# Altium schematic sheet ZHSD-DDR3L.SchDoc
size A3; DocumentNumber: 7; SheetNumber: 6; SheetTotal: 16; Size: A3
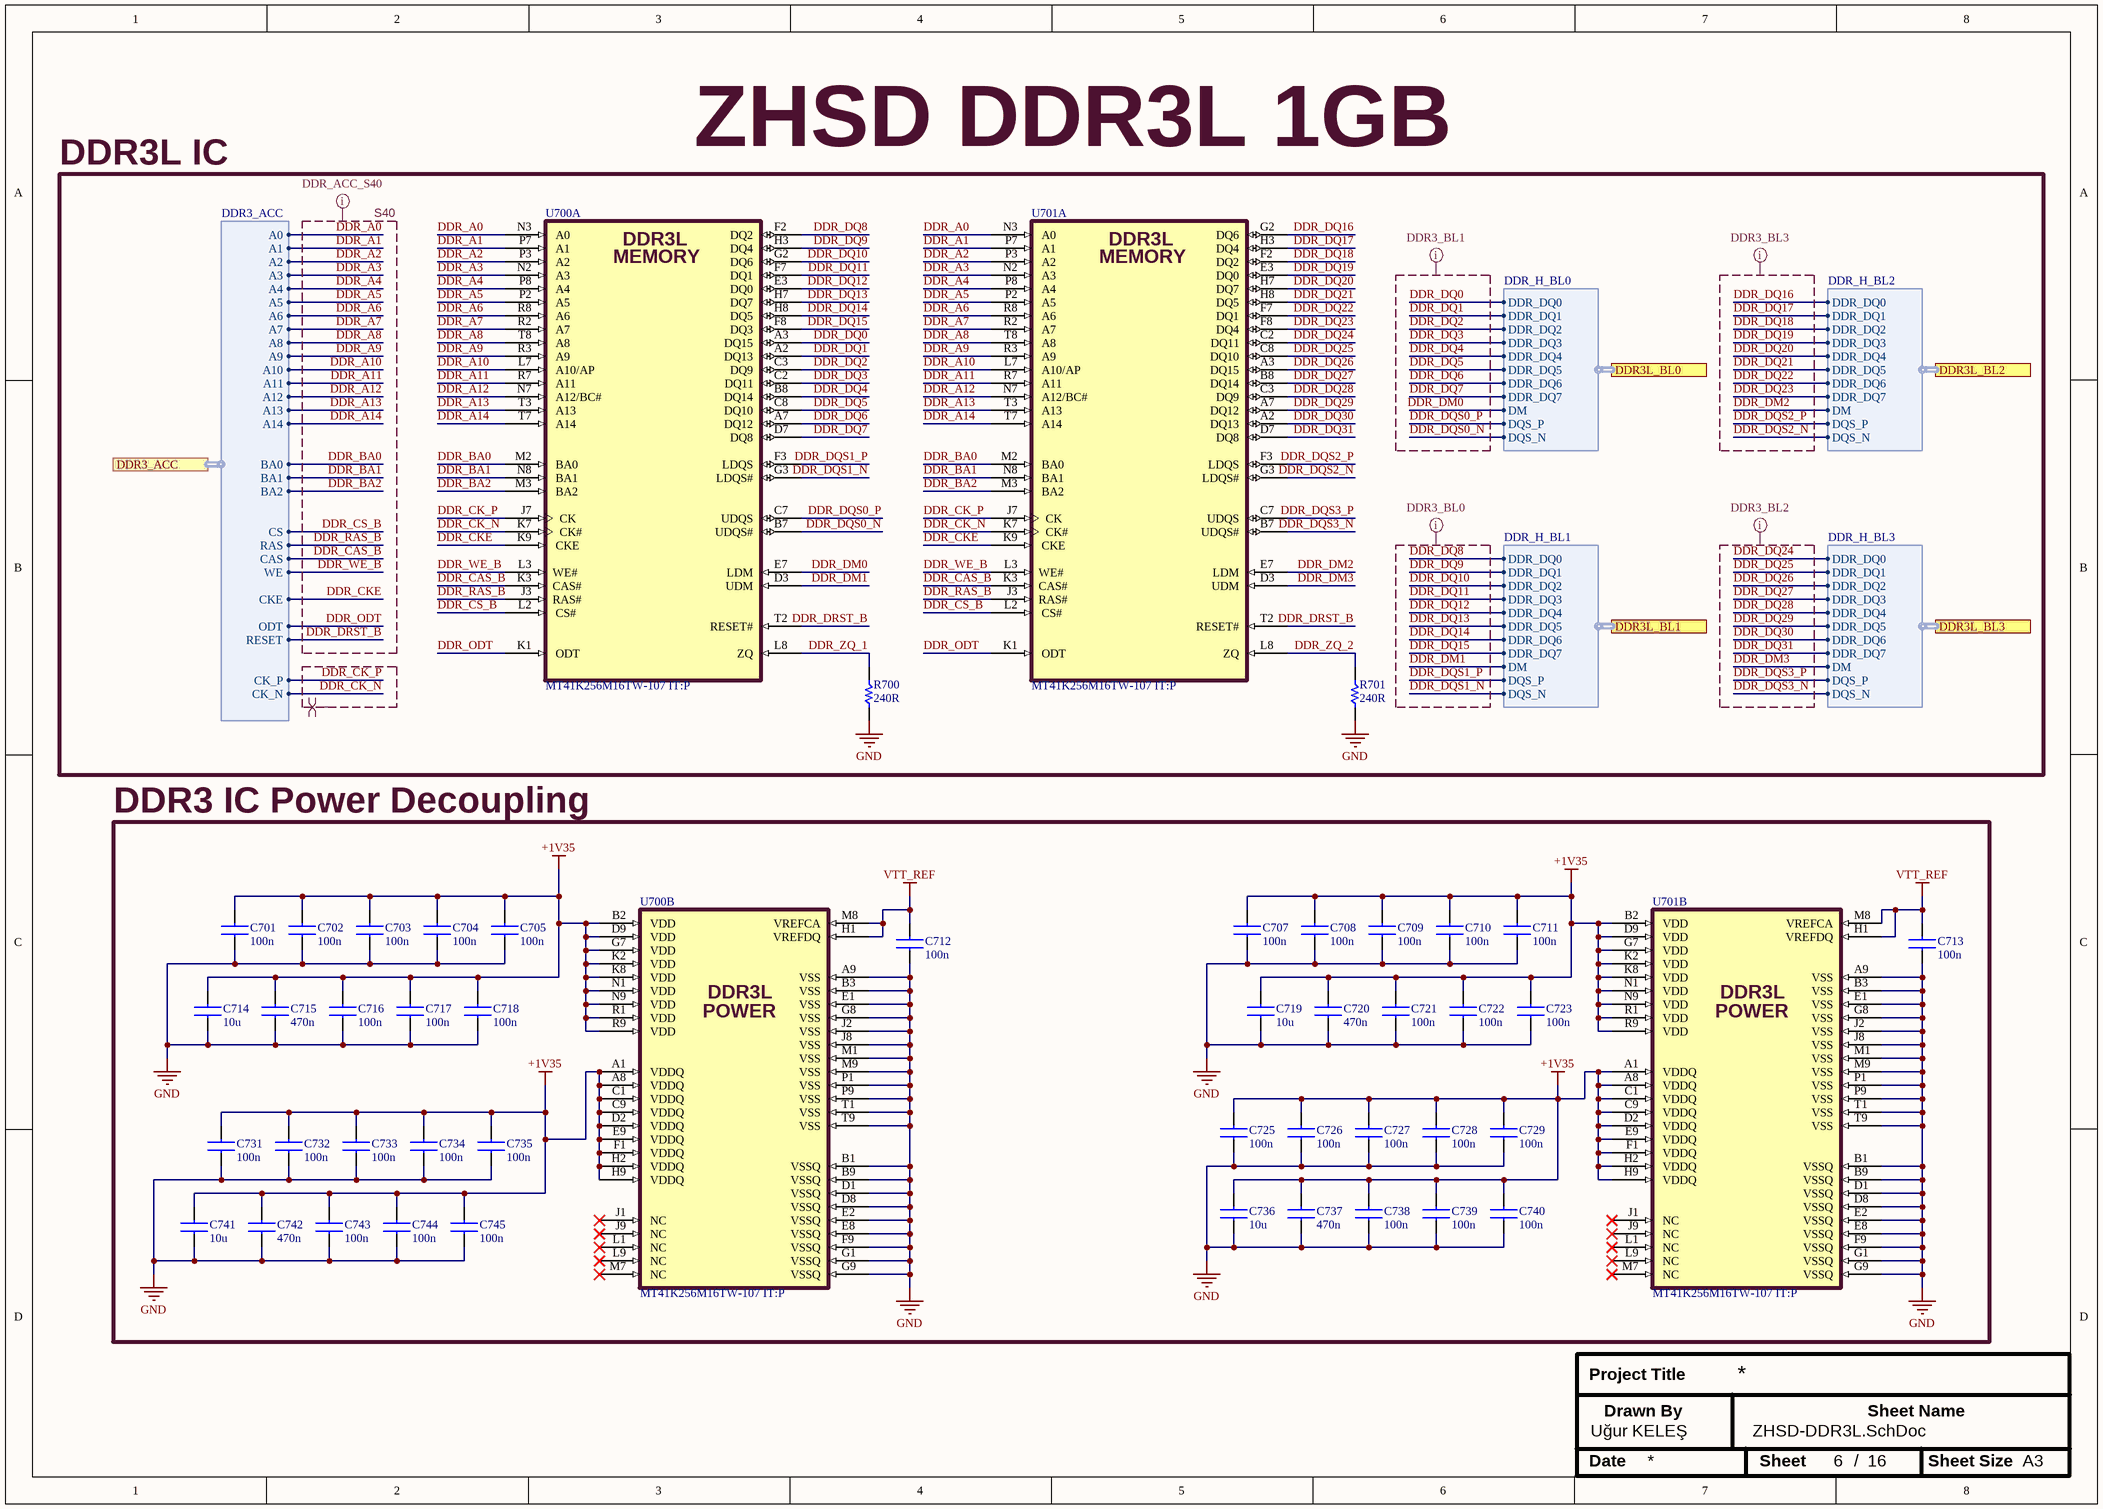
[diagram p0: ZHSD-DDR3L.SchDoc]

## Parts
C701  100n  [0402CAPC1005X06N]
C702  100n  [0402CAPC1005X06N]
C703  100n  [0402CAPC1005X06N]
C704  100n  [0402CAPC1005X06N]
C705  100n  [0402CAPC1005X06N]
C707  100n  [0402CAPC1005X06N]
C708  100n  [0402CAPC1005X06N]
C709  100n  [0402CAPC1005X06N]
C710  100n  [0402CAPC1005X06N]
C711  100n  [0402CAPC1005X06N]
C712  100n  [0402CAPC1005X06N]
C713  100n  [0402CAPC1005X06N]
C714  10u  [0603CAPC1608X09N]
C715  470n  [0402CAPC1005X06N]
C716  100n  [0402CAPC1005X06N]
C717  100n  [0402CAPC1005X06N]
C718  100n  [0402CAPC1005X06N]
C719  10u  [0603CAPC1608X09N]
C720  470n  [0402CAPC1005X06N]
C721  100n  [0402CAPC1005X06N]
C722  100n  [0402CAPC1005X06N]
C723  100n  [0402CAPC1005X06N]
C725  100n  [0402CAPC1005X06N]
C726  100n  [0402CAPC1005X06N]
C727  100n  [0402CAPC1005X06N]
C728  100n  [0402CAPC1005X06N]
C729  100n  [0402CAPC1005X06N]
C731  100n  [0402CAPC1005X06N]
C732  100n  [0402CAPC1005X06N]
C733  100n  [0402CAPC1005X06N]
C734  100n  [0402CAPC1005X06N]
C735  100n  [0402CAPC1005X06N]
C736  10u  [0603CAPC1608X09N]
C737  470n  [0402CAPC1005X06N]
C738  100n  [0402CAPC1005X06N]
C739  100n  [0402CAPC1005X06N]
C740  100n  [0402CAPC1005X06N]
C741  10u  [0603CAPC1608X09N]
C742  470n  [0402CAPC1005X06N]
C743  100n  [0402CAPC1005X06N]
C744  100n  [0402CAPC1005X06N]
C745  100n  [0402CAPC1005X06N]
R700  240R  [0402RESC1005X04N]
R701  240R  [0402RESC1005X04N]
U700  MT41K256M16TW-107 IT:P  [BGA96C80P9X16_900X1400X110]  (parts A,B of 2)
U701  MT41K256M16TW-107 IT:P  [BGA96C80P9X16_900X1400X110]  (parts A,B of 2)

## Blocks framed on the sheet
ZHSD DDR3L 1GB: R700 R701 U700 U701
DDR3 IC Power Decoupling: C701-C705 C707-C723 C725-C729 C731-C745 U700 U701

## Ports
DDR3_ACC (harness DDR3_ACC, see ZHSD-Block[8400,5100], ZHSD-ZYNQ-DDR[14000,6800]), DDR3L_BL0 (harness DDR_H_BL0, see ZHSD-Block[8400,6000], ZHSD-ZYNQ-DDR[1500,7300]), DDR3L_BL1 (harness DDR_H_BL1, see ZHSD-Block[8400,5800], ZHSD-ZYNQ-DDR[1500,5700]), DDR3L_BL2 (harness DDR_H_BL2, see ZHSD-Block[8400,5600], ZHSD-ZYNQ-DDR[1500,4100]), DDR3L_BL3 (harness DDR_H_BL3, see ZHSD-Block[8400,5400], ZHSD-ZYNQ-DDR[1500,2500])

## Harnesses
DDR3_ACC: A0, A1, A2, A3, A4, A5, A6, A7, A8, A9, A10, A11, A12, A13, BA0, BA1, CK_P, CK_N, CKE, WE, CAS, RAS, CS, ODT, RESET, BA2, A14
DDR_H_BL0: DDR_DQ0, DDR_DQ1, DDR_DQ2, DDR_DQ3, DDR_DQ4, DDR_DQ5, DDR_DQ6, DDR_DQ7, DM, DQS_P, DQS_N
DDR_H_BL1: DDR_DQ0, DDR_DQ1, DDR_DQ2, DDR_DQ3, DDR_DQ4, DDR_DQ5, DDR_DQ6, DDR_DQ7, DM, DQS_P, DQS_N
DDR_H_BL2: DDR_DQ0, DDR_DQ1, DDR_DQ2, DDR_DQ3, DDR_DQ4, DDR_DQ5, DDR_DQ6, DDR_DQ7, DM, DQS_P, DQS_N
DDR_H_BL3: DDR_DQ0, DDR_DQ1, DDR_DQ2, DDR_DQ3, DDR_DQ4, DDR_DQ5, DDR_DQ6, DDR_DQ7, DM, DQS_P, DQS_N

## Nets
+1V35: C701.2 C702.2 C703.2 C704.2 C705.2 C707.2 C708.2 C709.2 C710.2 C711.2 C714.2 C715.2 C716.2 C717.2 C718.2 C719.2 C720.2 C721.2 C722.2 C723.2 C725.2 C726.2 C727.2 C728.2 C729.2 C731.2 C732.2 C733.2 C734.2 C735.2 C736.2 C737.2 C738.2 C739.2 C740.2 C741.2 C742.2 C743.2 C744.2 C745.2 U700.A1(VDDQ) U700.A8(VDDQ) U700.B2(VDD) U700.C1(VDDQ) U700.C9(VDDQ) U700.D2(VDDQ) U700.D9(VDD) U700.E9(VDDQ) U700.F1(VDDQ) U700.G7(VDD) U700.H2(VDDQ) U700.H9(VDDQ) U700.K2(VDD) U700.K8(VDD) U700.N1(VDD) U700.N9(VDD) U700.R1(VDD) U700.R9(VDD) U701.A1(VDDQ) U701.A8(VDDQ) U701.B2(VDD) U701.C1(VDDQ) U701.C9(VDDQ) U701.D2(VDDQ) U701.D9(VDD) U701.E9(VDDQ) U701.F1(VDDQ) U701.G7(VDD) U701.H2(VDDQ) U701.H9(VDDQ) U701.K2(VDD) U701.K8(VDD) U701.N1(VDD) U701.N9(VDD) U701.R1(VDD) U701.R9(VDD)
GND: C701.1 C702.1 C703.1 C704.1 C705.1 C707.1 C708.1 C709.1 C710.1 C711.1 C712.1 C713.1 C714.1 C715.1 C716.1 C717.1 C718.1 C719.1 C720.1 C721.1 C722.1 C723.1 C725.1 C726.1 C727.1 C728.1 C729.1 C731.1 C732.1 C733.1 C734.1 C735.1 C736.1 C737.1 C738.1 C739.1 C740.1 C741.1 C742.1 C743.1 C744.1 C745.1 R700.1 R701.1 U700.A9(VSS) U700.B1(VSSQ) U700.B3(VSS) U700.B9(VSSQ) U700.D1(VSSQ) U700.D8(VSSQ) U700.E1(VSS) U700.E2(VSSQ) U700.E8(VSSQ) U700.F9(VSSQ) U700.G1(VSSQ) U700.G8(VSS) U700.G9(VSSQ) U700.J2(VSS) U700.J8(VSS) U700.M1(VSS) U700.M9(VSS) U700.P1(VSS) U700.P9(VSS) U700.T1(VSS) U700.T9(VSS) U701.A9(VSS) U701.B1(VSSQ) U701.B3(VSS) U701.B9(VSSQ) U701.D1(VSSQ) U701.D8(VSSQ) U701.E1(VSS) U701.E2(VSSQ) U701.E8(VSSQ) U701.F9(VSSQ) U701.G1(VSSQ) U701.G8(VSS) U701.G9(VSSQ) U701.J2(VSS) U701.J8(VSS) U701.M1(VSS) U701.M9(VSS) U701.P1(VSS) U701.P9(VSS) U701.T1(VSS) U701.T9(VSS)
VTT_REF: C712.2 C713.2 U700.H1(VREFDQ) U700.M8(VREFCA) U701.H1(VREFDQ) U701.M8(VREFCA)
DDR_A0: U700.N3(A0) U701.N3(A0) ; port DDR3_ACC.A0
DDR_A1: U700.P7(A1) U701.P7(A1) ; port DDR3_ACC.A1
DDR_A2: U700.P3(A2) U701.P3(A2) ; port DDR3_ACC.A2
DDR_A3: U700.N2(A3) U701.N2(A3) ; port DDR3_ACC.A3
DDR_A4: U700.P8(A4) U701.P8(A4) ; port DDR3_ACC.A4
DDR_A5: U700.P2(A5) U701.P2(A5) ; port DDR3_ACC.A5
DDR_A6: U700.R8(A6) U701.R8(A6) ; port DDR3_ACC.A6
DDR_A7: U700.R2(A7) U701.R2(A7) ; port DDR3_ACC.A7
DDR_A8: U700.T8(A8) U701.T8(A8) ; port DDR3_ACC.A8
DDR_A9: U700.R3(A9) U701.R3(A9) ; port DDR3_ACC.A9
DDR_A10: U700.L7(A10/AP) U701.L7(A10/AP) ; port DDR3_ACC.A10
DDR_A11: U700.R7(A11) U701.R7(A11) ; port DDR3_ACC.A11
DDR_A12: U700.N7(A12/BC#) U701.N7(A12/BC#) ; port DDR3_ACC.A12
DDR_A13: U700.T3(A13) U701.T3(A13) ; port DDR3_ACC.A13
DDR_A14: U700.T7(A14) U701.T7(A14) ; port DDR3_ACC.A14
DDR_BA0: U700.M2(BA0) U701.M2(BA0) ; port DDR3_ACC.BA0
DDR_BA1: U700.N8(BA1) U701.N8(BA1) ; port DDR3_ACC.BA1
DDR_BA2: U700.M3(BA2) U701.M3(BA2) ; port DDR3_ACC.BA2
DDR_CAS_B: U700.K3(CAS#) U701.K3(CAS#) ; port DDR3_ACC.CAS
DDR_CK_N: U700.K7(CK#) U701.K7(CK#) ; port DDR3_ACC.CK_N
DDR_CK_P: U700.J7(CK) U701.J7(CK) ; port DDR3_ACC.CK_P
DDR_CKE: U700.K9(CKE) U701.K9(CKE) ; port DDR3_ACC.CKE
DDR_CS_B: U700.L2(CS#) U701.L2(CS#) ; port DDR3_ACC.CS
DDR_DM0: U700.E7(LDM) ; port DDR3L_BL0.DM
DDR_DM1: U700.D3(UDM) ; port DDR3L_BL1.DM
DDR_DM2: U701.E7(LDM) ; port DDR3L_BL2.DM
DDR_DM3: U701.D3(UDM) ; port DDR3L_BL3.DM
DDR_DQ0: U700.A3(DQ15) ; port DDR3L_BL0.DDR_DQ0
DDR_DQ1: U700.A2(DQ13) ; port DDR3L_BL0.DDR_DQ1
DDR_DQ2: U700.C3(DQ9) ; port DDR3L_BL0.DDR_DQ2
DDR_DQ3: U700.C2(DQ11) ; port DDR3L_BL0.DDR_DQ3
DDR_DQ4: U700.B8(DQ14) ; port DDR3L_BL0.DDR_DQ4
DDR_DQ5: U700.C8(DQ10) ; port DDR3L_BL0.DDR_DQ5
DDR_DQ6: U700.A7(DQ12) ; port DDR3L_BL0.DDR_DQ6
DDR_DQ7: U700.D7(DQ8) ; port DDR3L_BL0.DDR_DQ7
DDR_DQ8: U700.F2(DQ2) ; port DDR3L_BL1.DDR_DQ0
DDR_DQ9: U700.H3(DQ4) ; port DDR3L_BL1.DDR_DQ1
DDR_DQ10: U700.G2(DQ6) ; port DDR3L_BL1.DDR_DQ2
DDR_DQ11: U700.F7(DQ1) ; port DDR3L_BL1.DDR_DQ3
DDR_DQ12: U700.E3(DQ0) ; port DDR3L_BL1.DDR_DQ4
DDR_DQ13: U700.H7(DQ7) ; port DDR3L_BL1.DDR_DQ5
DDR_DQ14: U700.H8(DQ5) ; port DDR3L_BL1.DDR_DQ6
DDR_DQ15: U700.F8(DQ3) ; port DDR3L_BL1.DDR_DQ7
DDR_DQ16: U701.G2(DQ6) ; port DDR3L_BL2.DDR_DQ0
DDR_DQ17: U701.H3(DQ4) ; port DDR3L_BL2.DDR_DQ1
DDR_DQ18: U701.F2(DQ2) ; port DDR3L_BL2.DDR_DQ2
DDR_DQ19: U701.E3(DQ0) ; port DDR3L_BL2.DDR_DQ3
DDR_DQ20: U701.H7(DQ7) ; port DDR3L_BL2.DDR_DQ4
DDR_DQ21: U701.H8(DQ5) ; port DDR3L_BL2.DDR_DQ5
DDR_DQ22: U701.F7(DQ1) ; port DDR3L_BL2.DDR_DQ6
DDR_DQ23: U701.F8(DQ4) ; port DDR3L_BL2.DDR_DQ7
DDR_DQ24: U701.C2(DQ11) ; port DDR3L_BL3.DDR_DQ0
DDR_DQ25: U701.C8(DQ10) ; port DDR3L_BL3.DDR_DQ1
DDR_DQ26: U701.A3(DQ15) ; port DDR3L_BL3.DDR_DQ2
DDR_DQ27: U701.B8(DQ14) ; port DDR3L_BL3.DDR_DQ3
DDR_DQ28: U701.C3(DQ9) ; port DDR3L_BL3.DDR_DQ4
DDR_DQ29: U701.A7(DQ12) ; port DDR3L_BL3.DDR_DQ5
DDR_DQ30: U701.A2(DQ13) ; port DDR3L_BL3.DDR_DQ6
DDR_DQ31: U701.D7(DQ8) ; port DDR3L_BL3.DDR_DQ7
DDR_DQS0_N: U700.B7(UDQS#) ; port DDR3L_BL0.DQS_N
DDR_DQS0_P: U700.C7(UDQS) ; port DDR3L_BL0.DQS_P
DDR_DQS1_N: U700.G3(LDQS#) ; port DDR3L_BL1.DQS_N
DDR_DQS1_P: U700.F3(LDQS) ; port DDR3L_BL1.DQS_P
DDR_DQS2_N: U701.G3(LDQS#) ; port DDR3L_BL2.DQS_N
DDR_DQS2_P: U701.F3(LDQS) ; port DDR3L_BL2.DQS_P
DDR_DQS3_N: U701.B7(UDQS#) ; port DDR3L_BL3.DQS_N
DDR_DQS3_P: U701.C7(UDQS) ; port DDR3L_BL3.DQS_P
DDR_DRST_B: U700.T2(RESET#) U701.T2(RESET#) ; port DDR3_ACC.RESET
DDR_ODT: U700.K1(ODT) U701.K1(ODT) ; port DDR3_ACC.ODT
DDR_RAS_B: U700.J3(RAS#) U701.J3(RAS#) ; port DDR3_ACC.RAS
DDR_WE_B: U700.L3(WE#) U701.L3(WE#) ; port DDR3_ACC.WE
DDR_ZQ_1: R700.2 U700.L8(ZQ)
DDR_ZQ_2: R701.2 U701.L8(ZQ)

Not connected (* = marked no-connect by the designer): U700 J1(_NC)* J9(_NC)* L1(_NC)* L9(_NC)* M7(_NC)*; U701 J1(_NC)* J9(_NC)* L1(_NC)* L9(_NC)* M7(_NC)*

## Layout directives
Impedance: S40; net class DDR3_ACC_S40: DDR_A0, DDR_A1, DDR_A2, DDR_A3, DDR_A4, DDR_A5, DDR_A6, DDR_A7, DDR_A8, DDR_A9, DDR_A10, DDR_A11, DDR_A12, DDR_A13, DDR_A14, DDR_BA0, DDR_BA1, DDR_BA2, DDR_CAS_B, DDR_CKE, DDR_CS_B, DDR_DRST_B, DDR_ODT, DDR_RAS_B, DDR_WE_B
differential pair: DDR_CK_N, DDR_CK_P
net class DDR3_BL1: DDR_DM0, DDR_DQ0, DDR_DQ1, DDR_DQ2, DDR_DQ3, DDR_DQ4, DDR_DQ5, DDR_DQ6, DDR_DQ7, DDR_DQS0_N, DDR_DQS0_P
net class DDR3_BL0: DDR_DM1, DDR_DQ8, DDR_DQ9, DDR_DQ10, DDR_DQ11, DDR_DQ12, DDR_DQ13, DDR_DQ14, DDR_DQ15, DDR_DQS1_N, DDR_DQS1_P
net class DDR3_BL3: DDR_DM2, DDR_DQ16, DDR_DQ17, DDR_DQ18, DDR_DQ19, DDR_DQ20, DDR_DQ21, DDR_DQ22, DDR_DQ23, DDR_DQS2_N, DDR_DQS2_P
net class DDR3_BL2: DDR_DM3, DDR_DQ24, DDR_DQ25, DDR_DQ26, DDR_DQ27, DDR_DQ28, DDR_DQ29, DDR_DQ30, DDR_DQ31, DDR_DQS3_N, DDR_DQS3_P

## Notes on the sheet
- DDR3L IC
- Project Title
- Uğur KELEŞ
- Drawn By
- Sheet Name
- Date
- Sheet
- /
- Sheet Size
- A3
- (in symbol MT41K256M16TW-107 IT:P, part A) DDR3L; MEMORY
- (in symbol MT41K256M16TW-107 IT:P, part B) DDR3L; POWER

## Library data of the parts
C701-C705 C707-C713 C716-C718 C721-C723 C725-C729 C731-C735 C738-C740 C743-C745 = GRM155R71C104KA88J: CAP CER 0.1UF 16V X7R 0402 (1005) ±10%; Manufacturer: Murata Electronics; Value: 0.1 µF; ComponentLink1Description: Datasheet; ComponentLink1URL: https://search.murata.co.jp/Ceramy/image/img/A01X/G101/ENG/GRM155R71C104KA88-01.pdf; MPN: GRM155R71C104KA88J; Package: 0402; Tolerance: ±10%; Voltage: 16V
C714 C719 C736 C741 = GRM188Z71A106MA73D: CAP CER 10UF 10V X7R 0603 (1608) ±20%; Manufacturer: Murata Electronics; Value: 10 µF; ComponentLink1Description: Datasheet; ComponentLink1URL: https://search.murata.co.jp/Ceramy/image/img/A01X/G101/ENG/GRM188Z71A106MA73-01A.pdf; MPN: GRM188Z71A106MA73D; Package: 0603; Tolerance: ±20%; Voltage: 10V
C715 C720 C737 C742 = GRM155R60J474KE19D: CAP CER 0.47UF 6.3V X5R 0402(1005) ±10%; Manufacturer: Murata Electronics; Value: 0.47 µF; ComponentLink1Description: Datasheet; ComponentLink1URL: https://search.murata.co.jp/Ceramy/image/img/A01X/G101/ENG/GRM21BR71A475KE51-01.pdf; MPN: GRM155R60J474KE19D; Package: 0402; Tolerance: ±10%; Voltage: 6.3V
R700 R701 = RC0402FR-07240RL: RES 240 OHM 1% 1/16W 0402 (1005); Manufacturer: YAGEO; Value: 240 Ohms; Voltage: 50V; ComponentLink1Description: Datasheet; ComponentLink1URL: https://yageogroup.com/content/datasheet/asset/file/PYU-RC_GROUP_51_ROHS_L; MPN: RC0402FR-07240RL; Tolerance: ±1%; Package: 0402
U700 U701 = MT41K256M16TW-107 IT:P: SDRAM - DDR3L Memory IC 4Gbit Parallel 933 MHz 20 ns 96-FBGA (8x14); Manufacturer: Micron Technology Inc.; MPN: MT41K256M16TW-107 IT:P; ComponentLink1Description: Datasheet; ComponentLink1URL: https://datasheet.octopart.com/MT41K256M16TW-107%3AP-Micron-datasheet-149527670.pdf